# Altium schematic sheet Potencia.SchDoc: Circuito de Potencia
size A4; Author: Agustin Zuliani; Revision: Rev: 00; SheetNumber: 5; SheetTotal: 7
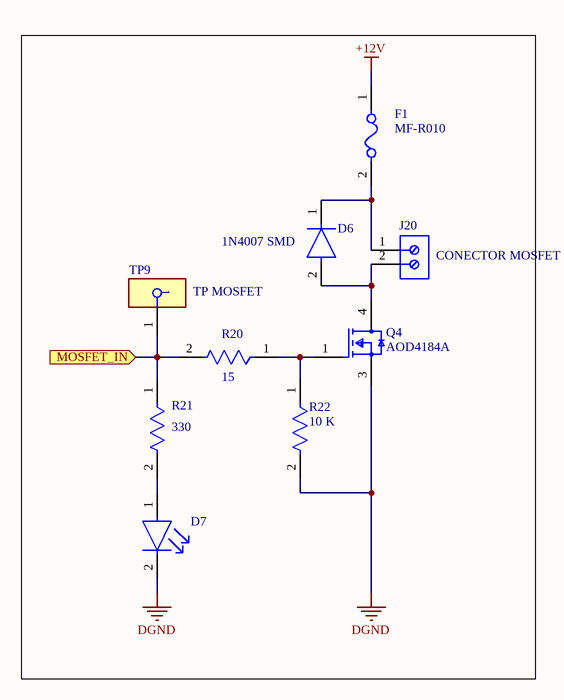
[diagram p0: Potencia.SchDoc]

## Parts
D6  1N4007 SMD  [FP-1N4007_SMD-IPC_C]
D7  SM0805YCL  [FP-SM0805YCL-MFG]  (value not drawn)
F1  MF-R010  [FP-MF-R010-MFG]
J20  CONECTOR MOSFET  [691102710002]
Q4  AOD4184A  [FP-TO252-MFG]
R20  15  [FP-RN73R2A-IPC_A]
R21  330  [FP-RN73R2A-IPC_A]
R22  10 K  [FP-RN73R2A-IPC_A]
TP9  TP MOSFET  [FP-5004-MFG]

## Ports
MOSFET_IN (in)

## Nets
+12V: F1.1
DGND: D7.2(C) Q4.3(S) R22.2
MOSFET_IN: R20.2 R21.1 TP9.1 ; port MOSFET_IN
NetD6_1: D6.1(C) F1.2 J20.1
NetD6_2: D6.2(A) J20.2 Q4.4(D)
NetD7_1: D7.1(A) R21.2
NetQ4_1: Q4.1(G) R20.1 R22.1

## Library data of the parts
D6 = CMP-12389-000001-1: DIODE 1N4148 THT / Proteccion Mosfet
D7 = CMP-35283-000007-1: LED SMD 0805 / Mosfet status; Luminous Intensity: 11.5mcd; Illumination Color: Yellow; Test Current: 2mA; Viewing Angle: 130°; Lens Transparency: Clear; Dominant Wavelength: 592nm; Forward Voltage: 1.9V; Lens Color: Colorless; Case Code (Metric): 2012; Length: 2mm; Max Operating Temperature: 80°C; Width: 1.2mm; Case Code (Imperial): 0805; Packaging: Tape and Reel; Mount: Surface Mount; Case/Package: 0805; Forward Current: 2mA; Height: 0.8mm; Lead Free: Lead Free; Min Operating Temperature: -30°C; Color: Yellow; Package Quantity: 4000
F1 = CMP-07400-000011-1: PTC RESET FUSE 60V 100MA RADIAL; Manufacturer: Bourns Inc.; Hold Current: 0.1A; Current Rating: 40A; Trip Current: 0.2A; Resistance: 2.5-7.5Ω; Trip Time: 4s; Value: 2.5-7.5Ω; Temperature Range High: +85°C; Mouser Description: Resettable Fuses - PPTC 60v Max 40Amps Max Hold .10 Trip .20; Manufacturer Part Number: MF-R010; Digikey Description: PTC RESET FUSE 60V 100MA RADIAL; Device Class L3: unset; Temperature Range Low: -40°C; Octopart: https://octopart.com/mf-r010-bourns-5791; Ambient Temperature Range Low: -40°C; Ambient Temperature Range High: +85°C; ComponentLink2Description: Datasheet; ComponentLink2URL: https://www.bourns.com/docs/Product-Datasheets/mfr.pdf; Automotive: No; Device Class L1: Circuit Protection; Device Class L2: PTC Resettable Fuses; Height: 12.7mm; Voltage Rating: 60V; RoHS: TRUE; Category: Fuse; Package: MF-R010; Lead Free: Yes; Temperature: -40°C to +85°C
J20 = CMP-1502-03258-2: TERMINAL BLOCK 2 POS / Salida Mosfet; NexarPartId: 8917706; Number of Levels: 1; Number of Positions Per Level: 2; Current: 15A; Voltage: 300V; Pitch: 5.0038mm; Plating: Steel; Stripping Length: -6mm; Wire Gauge (Min): 14AWG; Wire Gauge (Max): 22AWG; Length: 7.5mm; Contact Material: Brass; Contact Plating: Tin; Packaging: Box; Number of Pins: 2; Voltage Rating: 300V; Termination: Screw; Number of Contacts: 2; Color: Blue; Current Rating: 15A; Mount: Through Hole; Max Operating Temperature: 105°C; Min Operating Temperature: -40°C; REACH SVHC: Unknown; Height: 13.4mm; Width: 11.2mm; Housing Material: Nylon; RoHS: Compliant; Wire/Cable Gauge: 22AWG; Lead Pitch: 5mm
Q4 = CMP-83955-000007-1: MOSFET N AOD4148A TO252; Drain to Source Voltage (Vdss): 40V; Power Dissipation: 50W; Rds On Max: 7mR; Input Capacitance: 1.8nF; Gate to Source Voltage (Vgs): 20V; Continuous Drain Current (ID): 50A; Number of Elements: 1; Max Power Dissipation: 2.3W; Min Operating Temperature: -55°C; Max Operating Temperature: 175°C; Case/Package: DPAK; Mount: Surface Mount; Packaging: Cut Tape; Number of Pins: 3; Radiation Hardening: No
R20 = CMP-04015-052084-1: RES 15R 5% 0805
R21 = CMP-04015-052084-1: RES 330R 5% 0805
R22 = CMP-04015-052084-1: RES 10K 5% 0805
TP9 = CMP-2000-05575-2: PC TEST POINT MINIATURE YELLOW; Manufacturer: Keystone; Manufacturer Part Number: 5004; Number Of Contacts: 1; Is Female: yes; Device Class L1: Connectors; Digikey Description: PC TEST POINT MINIATURE YELLOW; ComponentLink2URL: https://www.keyelco.com/product-pdf.cfm?p=1313; Lead Free: Yes; ComponentLink2Description: Datasheet; Category: Conn; Height: 4.72mm; Octopart: https://octopart.com/5004-keystone-28591; Mouser Description: TEST POINT PC MINI .040"D YELLOW; Device Class L3: unset; Contact Material: Silver; Package: 5004; Automotive: No; Device Class L2: unset; RoHS: TRUE